# EAGLE design 525_kaya (EAGLE 9.6.2)
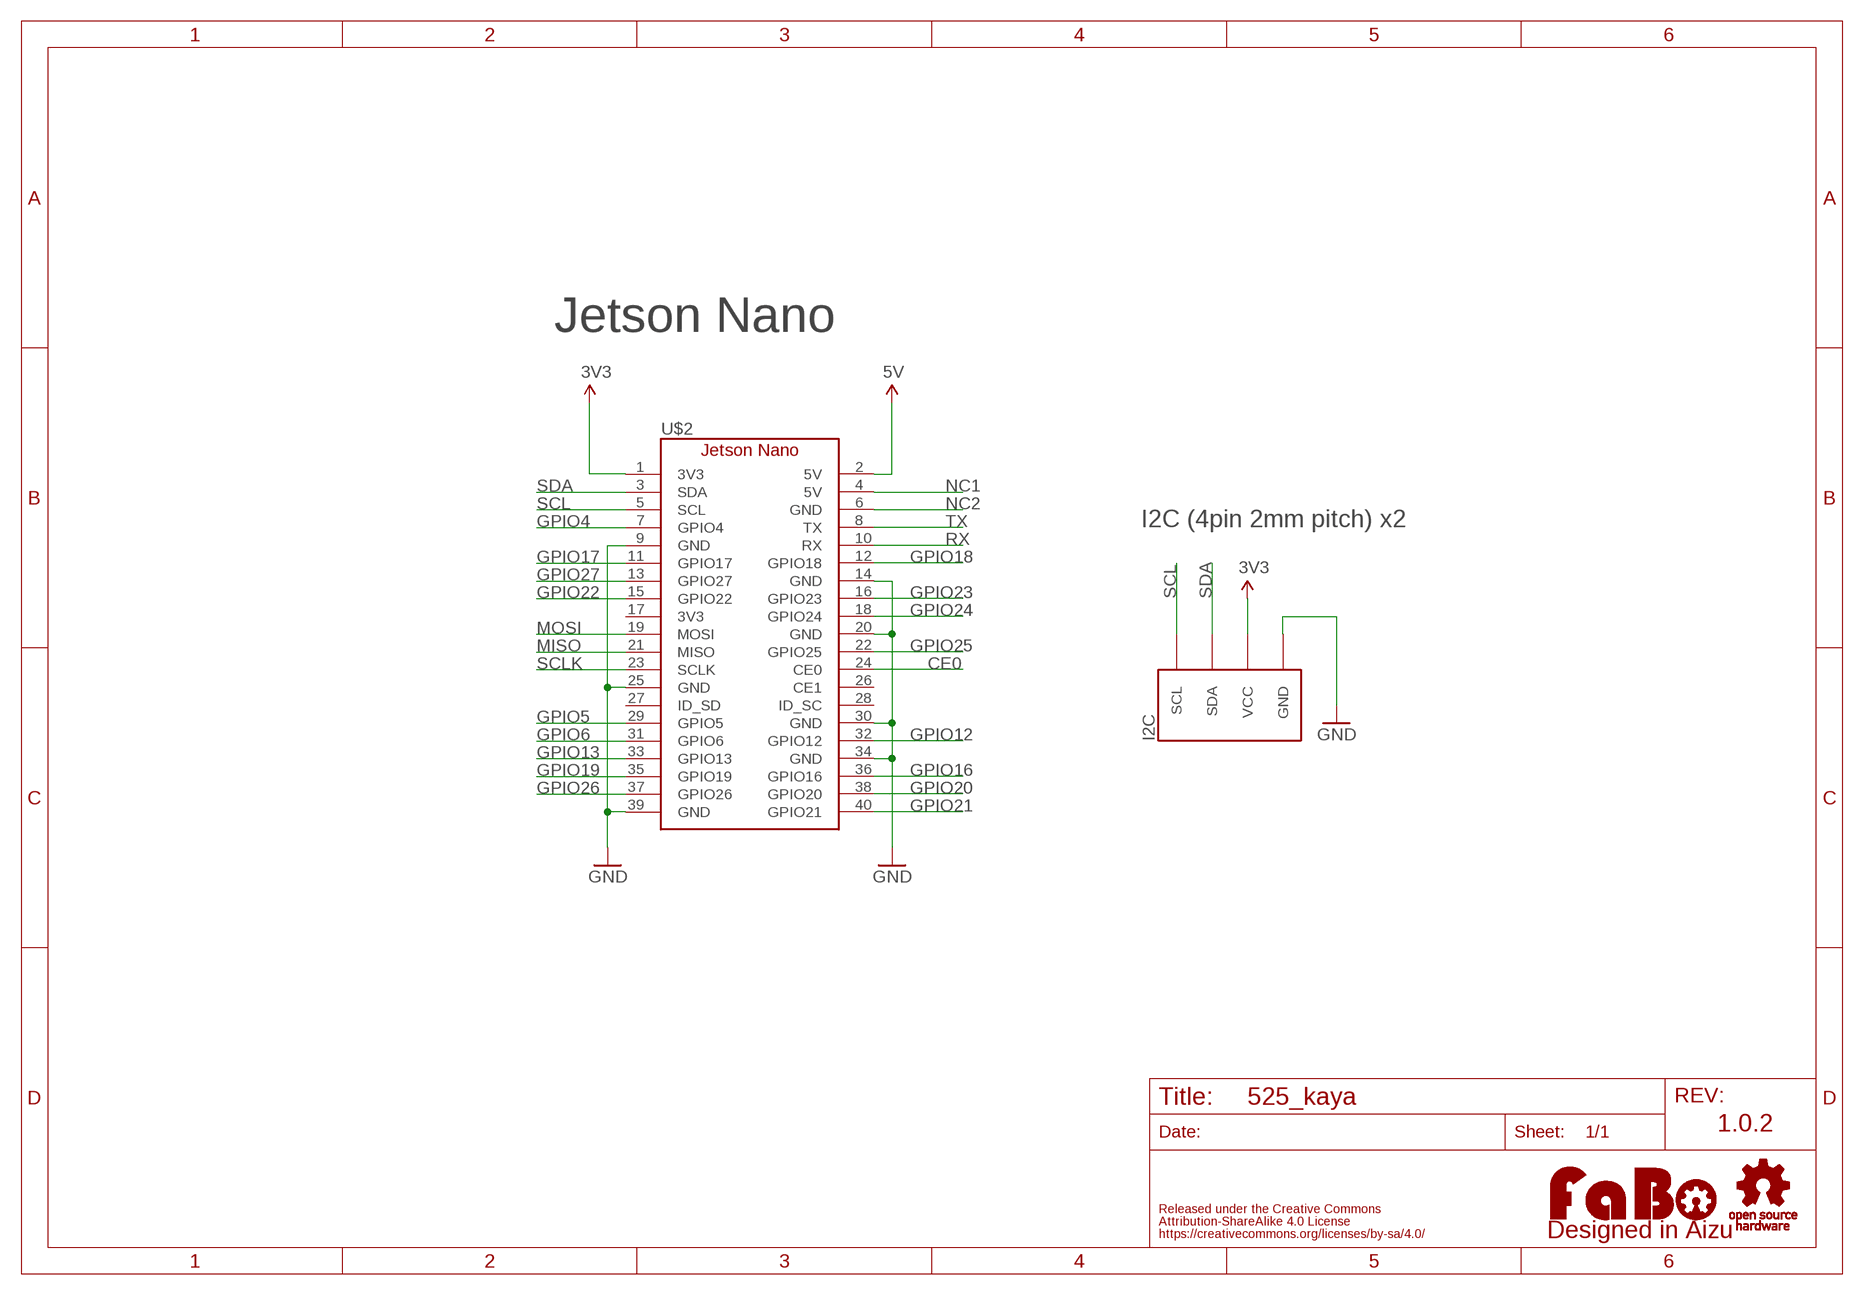
[diagram p0: schematic, sheet 1]

## Parts
I2C  FABO_BRICK_I2C-B04B-PASK-1  [FABO_BRICK_I2C_B04B-PASK-1]
LOGO1  LOGO_FABO-M  [LOGO_FABO_M]
U$2  JETSON_NANO_NOBORDER  [JETSON_NANO_NOBOARDER]
U$3  LOGO_OSHW-M_BOTTOM  [LOGO_OSHW_M_BOTTOM]

## Nets
3V3: I2C.VCC U$2.1(3V3)
5V: U$2.2(5V)
CE0: U$2.24(CE0)
GND: I2C.GND U$2.9(GND) U$2.14(GND) U$2.20(GND) U$2.25(GND) U$2.30(GND) U$2.34(GND) U$2.39(GND)
GPIO4: U$2.7(GPIO4)
GPIO5: U$2.29(GPIO5)
GPIO6: U$2.31(GPIO6)
GPIO12: U$2.32(GPIO12)
GPIO13: U$2.33(GPIO13)
GPIO16: U$2.36(GPIO16)
GPIO17: U$2.11(GPIO17)
GPIO18: U$2.12(GPIO18)
GPIO19: U$2.35(GPIO19)
GPIO20: U$2.38(GPIO20)
GPIO21: U$2.40(GPIO21)
GPIO22: U$2.15(GPIO22)
GPIO23: U$2.16(GPIO23)
GPIO24: U$2.18(GPIO24)
GPIO25: U$2.22(GPIO25)
GPIO26: U$2.37(GPIO26)
GPIO27: U$2.13(GPIO27)
MISO: U$2.21(MISO)
MOSI: U$2.19(MOSI)
NC1: U$2.4(5V)
NC2: U$2.6(GND)
RX: U$2.10(RX)
SCL: I2C.SCL U$2.5(SCL)
SCLK: U$2.23(SCLK)
SDA: I2C.SDA U$2.3(SDA)
TX: U$2.8(TX)
Unconnected: U$2.17(3V3) U$2.26(CE1) U$2.27(ID_SD) U$2.28(ID_SC)

## Notes on the sheet
- Jetson Nano
- I2C (4pin 2mm pitch) x2
- 1.0.2

## Library data of the parts
I2C = FaBo-Template:FABO_BRICK_I2C: FaBo Brick I2C
LOGO1 = component:LOGO_FABO
U$2 = FaBo-Boards:JETSON_NANO
U$3 = component:LOGO_OSHW

## Board
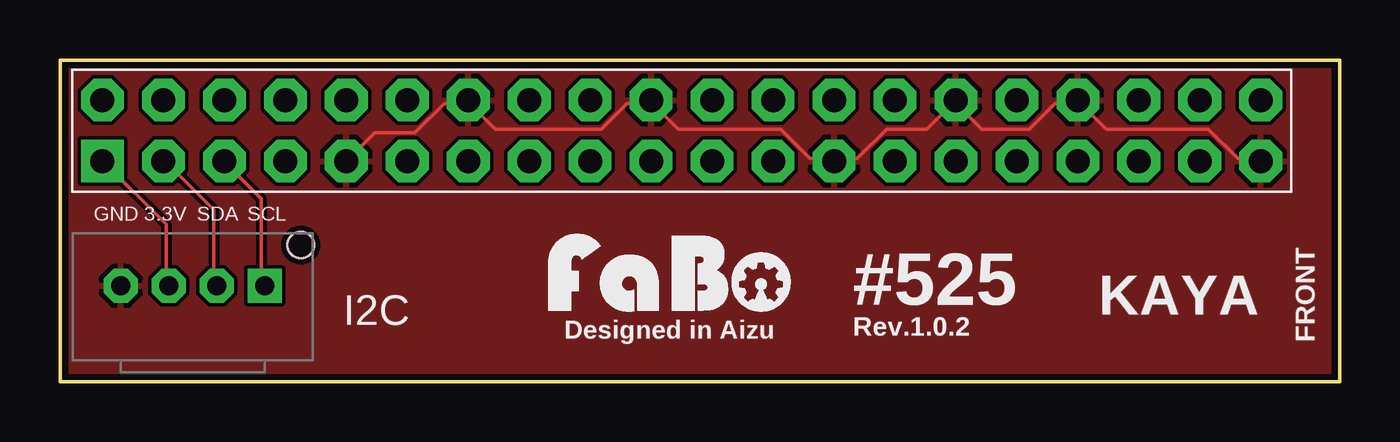
[diagram p1: board, top side]
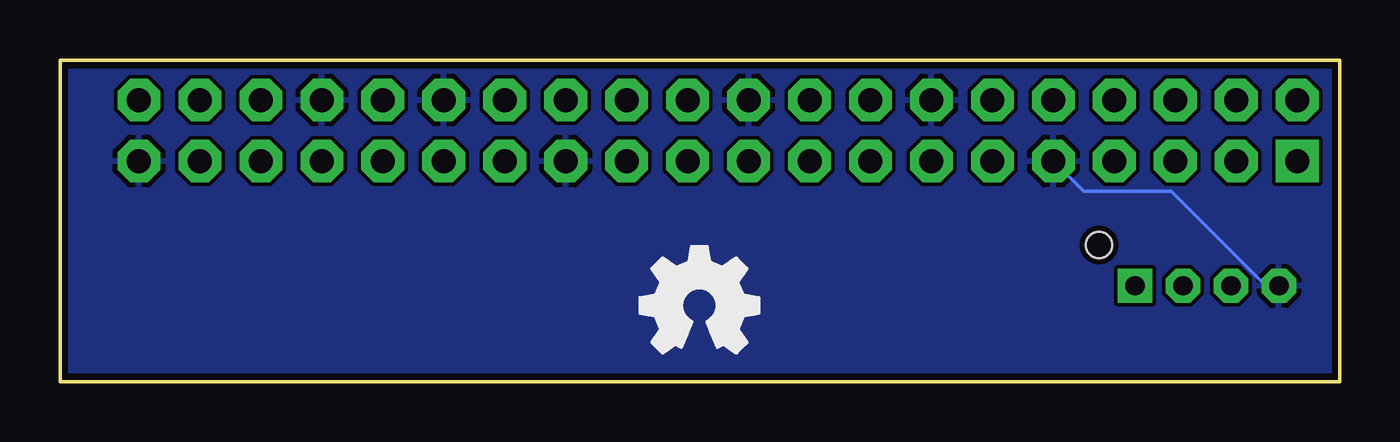
[diagram p2: board, bottom side, seen from below]

Size 53.32 x 13.4 mm. Coordinates in mm from the lower left corner, seen from the top.
Outline: 0,0 53.32,0 53.32,13.4 0,13.4 0,0
Copper layers (1*16): Top 0.035mm / dielectric 1.6mm / Bottom 0.035mm
Design rules "PCBway": minimum track width 6mil, minimum drill 12mil, track to track 6mil, track to pad 6mil, pad to pad 6mil, via to via 6mil, smd to smd 6mil, copper to edge 10mil, drill to drill 10mil, minimum pad ring 10mil, minimum via ring 6mil, stop-mask expansion 2mil, vias tented up to drill 100mil, thermal gap 8mil

### Footprints (pad centres in the part's own frame; a part is rotated, then mirrored left to right if it is on the bottom)
FABO_BRICK_I2C_B04B-PASK-1 = drill 0.8 pad 1.422 octagon: GND -3,0; SDA 1,0; VCC -1,0 | drill 0.8 pad 1.422 square: SCL 3,0 | hole 1.1: 4.5,1.7
JETSON_NANO_NOBOARDER = drill 1 pad 1.778 square: 1 1.27,1.27 | drill 1 pad 1.778 octagon: 2 1.27,3.81; 3 3.81,1.27; 4 3.81,3.81; 5 6.35,1.27; 6 6.35,3.81; 7 8.89,1.27; 8 8.89,3.81; 9 11.43,1.27; 10 11.43,3.81; 11 13.97,1.27; 12 13.97,3.81; 13 16.51,1.27; 14 16.51,3.81; 15 19.05,1.27; 16 19.05,3.81; 17 21.59,1.27; 18 21.59,3.81; 19 24.13,1.27; 20 24.13,3.81; 21 26.67,1.27; 22 26.67,3.81; 23 29.21,1.27; 24 29.21,3.81; 25 31.75,1.27; 26 31.75,3.81; 27 34.29,1.27; 28 34.29,3.81; 29 36.83,1.27; 30 36.83,3.81; 31 39.37,1.27; 32 39.37,3.81; 33 41.91,1.27; 34 41.91,3.81; 35 44.45,1.27; 36 44.45,3.81; 37 46.99,1.27; 38 46.99,3.81; 39 49.53,1.27; 40 49.53,3.81

### Placement (x,y rotation side)
I2C  5.53,3.99 0 top
LOGO1  25.4,2.54 0 top
U$2  0.5,7.92 0 top
U$3  26.67,3.17 0 top

### Tracks (layer width: path | path; a pad name or v marks a point on that pad's centre or on a via)
3V3
  Top 0.152: I2C.VCC 4.42,4.12 4.42,6.55 1.83,9.14 U$2.1
GND
  Top 0.152: U$2.39 49.99,9.3 49.07,9.3 47.85,10.52 43.59,10.52 42.52,11.58 U$2.34 42.37,11.58 41.45,11.58 40.39,10.52 38.41,10.52 37.34,11.58 U$2.30 37.19,11.58 36.12,10.52 34.44,10.52 33.22,9.3 32.31,9.3 U$2.25 32.16,9.3 31.24,9.3 30.02,10.52 25.76,10.52 24.69,11.58 U$2.20 24.54,11.58 23.62,11.58 22.55,10.52 18.14,10.52 17.07,11.58 U$2.14 16.92,11.58 16,11.58 14.78,10.36 13.11,10.36 12.04,9.3 U$2.9
  Bottom 0.152: I2C.GND 2.59,4.12 3.2,4.12 7.01,7.92 10.67,7.92 11.89,9.14 U$2.9
  pour Top: 0,0 0,13.97 53.34,13.97 53.34,0
  pour Bottom: 0,0 53.34,0 53.34,13.97 0,13.97
SCL
  Top 0.152: I2C.SCL 8.38,4.12 8.38,7.62 6.86,9.14 U$2.5
SDA
  Top 0.152: I2C.SDA 6.4,4.12 6.4,7.16 4.42,9.14 U$2.3

### Text on the board
tPlace: GND | 3.3V | SDA | SCL | Designed in Aizu | #525 | KAYA | Rev.1.0.2 | FRONT